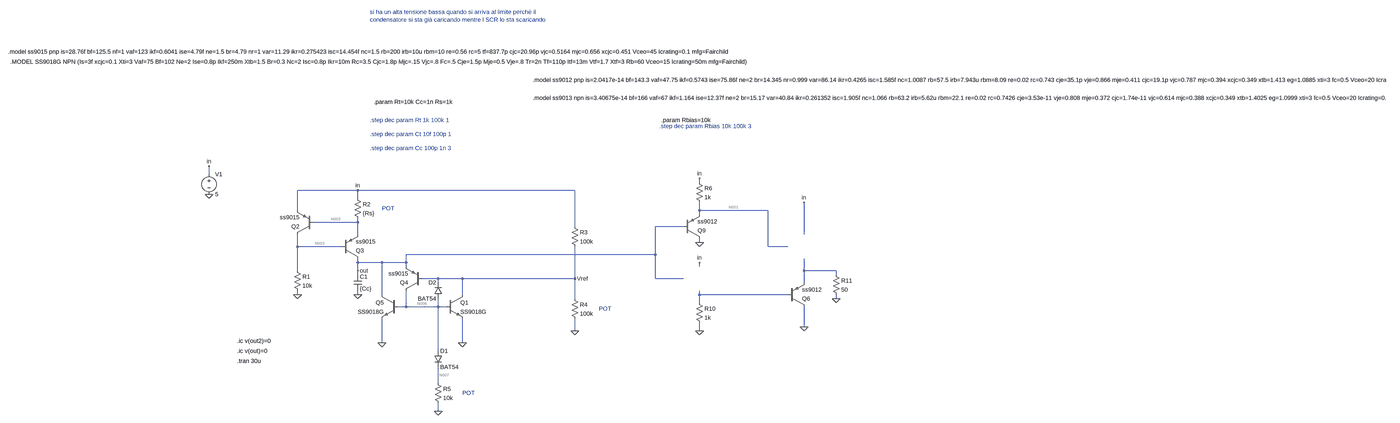
[diagram p0: schematic Sawtooth pier_2.asc, whole sheet]
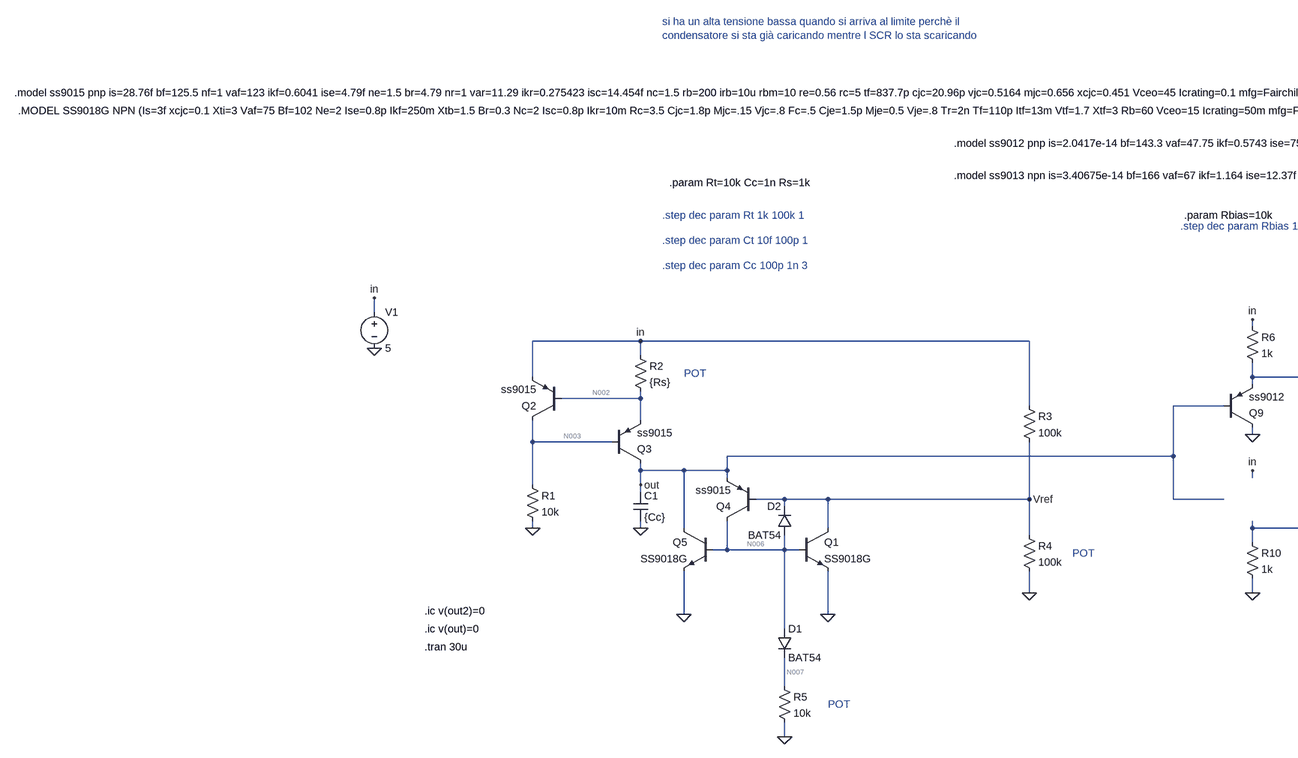
[diagram p1: schematic Sawtooth pier_2.asc, part, row 1 of 1, column 1 of 2]
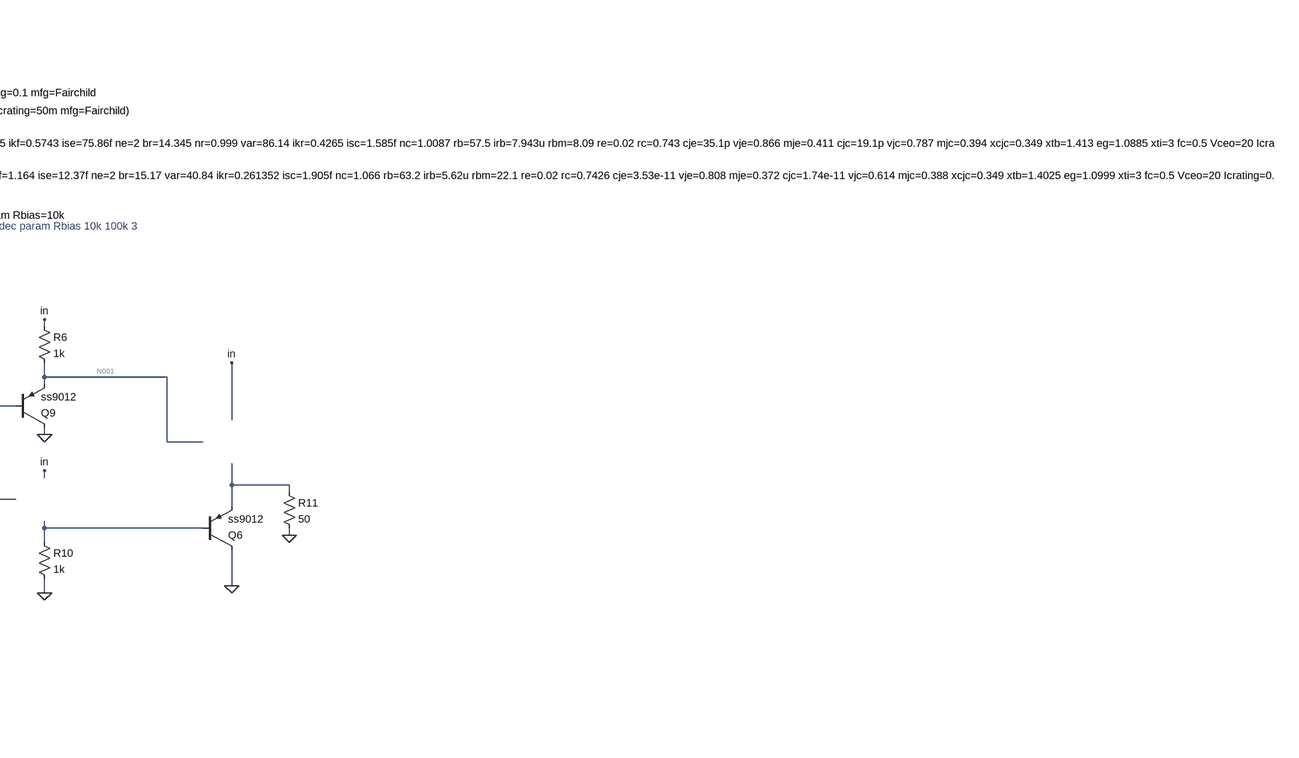
[diagram p2: schematic Sawtooth pier_2.asc, part, row 1 of 1, column 2 of 2]
Sawtooth pier_2.asc, the LTspice schematic file:
Version 4.1
SHEET 1 5468 1760
WIRE -320 -64 -320 -96
WIRE 1632 -32 1632 -48
WIRE 272 0 32 0
WIRE 1136 0 272 0
WIRE 272 32 272 0
WIRE 32 80 32 0
WIRE 1632 80 1632 48
WIRE 1904 80 1632 80
WIRE 1632 96 1632 80
WIRE 272 128 272 112
WIRE 272 128 96 128
WIRE 1136 144 1136 0
WIRE 1568 144 1456 144
WIRE 272 176 272 128
WIRE 2048 176 2048 48
WIRE 1632 208 1632 192
WIRE 32 224 32 176
WIRE 208 224 32 224
WIRE 1904 224 1904 80
WIRE 1984 224 1904 224
WIRE 1456 256 1456 144
WIRE 1456 256 464 256
WIRE 272 288 272 272
WIRE 368 288 272 288
WIRE 464 288 464 256
WIRE 464 288 368 288
WIRE 464 304 464 288
WIRE 1632 304 1632 288
WIRE 32 320 32 224
WIRE 272 320 272 288
WIRE 2048 320 2048 272
WIRE 2176 320 2048 320
WIRE 272 336 272 320
WIRE 2176 336 2176 320
WIRE 592 352 528 352
WIRE 688 352 592 352
WIRE 1136 352 1136 224
WIRE 1136 352 688 352
WIRE 1456 352 1456 256
WIRE 1568 352 1456 352
WIRE 592 368 592 352
WIRE 2048 368 2048 320
WIRE 32 416 32 400
WIRE 272 416 272 400
WIRE 368 416 368 288
WIRE 688 416 688 352
WIRE 1632 416 1632 400
WIRE 1984 416 1632 416
WIRE 1136 432 1136 352
WIRE 2176 432 2176 416
WIRE 1632 448 1632 416
WIRE 464 464 464 400
WIRE 464 464 432 464
WIRE 592 464 592 432
WIRE 592 464 464 464
WIRE 624 464 592 464
WIRE 2048 544 2048 464
WIRE 1136 560 1136 512
WIRE 1632 560 1632 528
WIRE 368 608 368 512
WIRE 688 608 688 512
WIRE 592 640 592 464
WIRE 592 768 592 704
WIRE 592 880 592 848
FLAG -320 16 0
FLAG -320 -96 in
FLAG 32 416 0
FLAG 272 416 0
FLAG 1136 560 0
FLAG 688 608 0
FLAG 272 320 out
FLAG 368 608 0
FLAG 272 0 in
FLAG 592 880 0
FLAG 1136 352 Vref
FLAG 2048 48 in
FLAG 2048 544 0
FLAG 1632 560 0
FLAG 1632 208 0
FLAG 1632 288 in
FLAG 1632 -48 in
FLAG 2176 432 0
SYMBOL voltage -320 -80 R0
WINDOW 123 0 0 Left 0
WINDOW 39 0 0 Left 0
SYMATTR InstName V1
SYMATTR Value 5
SYMBOL res 16 304 R0
SYMATTR InstName R1
SYMATTR Value 10k
SYMBOL res 256 16 R0
SYMATTR InstName R2
SYMATTR Value {Rs}
SYMBOL cap 256 336 R0
SYMATTR InstName C1
SYMATTR Value {Cc}
SYMBOL res 1120 128 R0
SYMATTR InstName R3
SYMATTR Value 100k
SYMBOL res 1120 416 R0
SYMATTR InstName R4
SYMATTR Value 100k
SYMBOL npn 624 416 R0
SYMATTR InstName Q1
SYMATTR Value SS9018G
SYMBOL pnp 96 176 R180
SYMATTR InstName Q2
SYMATTR Value ss9015
SYMBOL res 576 752 R0
SYMATTR InstName R5
SYMATTR Value 10k
SYMBOL diode 576 640 R0
SYMATTR InstName D1
SYMATTR Value BAT54
SYMBOL diode 608 432 R180
WINDOW 0 24 64 Left 2
WINDOW 3 24 0 Left 2
SYMATTR InstName D2
SYMATTR Value BAT54
SYMBOL pnp 208 272 M180
SYMATTR InstName Q3
SYMATTR Value ss9015
SYMBOL pnp 528 400 R180
SYMATTR InstName Q4
SYMATTR Value ss9015
SYMBOL npn 432 416 M0
SYMATTR InstName Q5
SYMATTR Value SS9018G
SYMBOL res 1616 432 R0
SYMATTR InstName R10
SYMATTR Value 1k
SYMBOL pnp 1568 192 M180
SYMATTR InstName Q9
SYMATTR Value ss9012
SYMBOL res 1616 -48 R0
SYMATTR InstName R6
SYMATTR Value 1k
SYMBOL res 2160 320 R0
SYMATTR InstName R11
SYMATTR Value 50
SYMBOL pnp 1984 464 M180
SYMATTR InstName Q6
SYMATTR Value ss9012
TEXT 320 -280 Left 2 ;.step dec param Rt 1k 100k 1
TEXT 336 -352 Left 2 !.param Rt=10k Cc=1n Rs=1k
TEXT 320 -224 Left 2 ;.step dec param Ct 10f 100p 1
TEXT -1120 -552 Left 2 !.model ss9015 pnp is=28.76f bf=125.5 nf=1 vaf=123 ikf=0.6041 ise=4.79f ne=1.5 br=4.79 nr=1 var=11.29 ikr=0.275423 isc=14.454f nc=1.5 rb=200 irb=10u rbm=10 re=0.56 rc=5 tf=837.7p cjc=20.96p vjc=0.5164 mjc=0.656 xcjc=0.451 Vceo=45 Icrating=0.1 mfg=Fairchild
TEXT -1112 -512 Left 2 !.MODEL SS9018G NPN (Is=3f xcjc=0.1 Xti=3 Vaf=75 Bf=102 Ne=2 Ise=0.8p Ikf=250m Xtb=1.5 Br=0.3 Nc=2 Isc=0.8p Ikr=10m Rc=3.5 Cjc=1.8p Mjc=.15 Vjc=.8 Fc=.5 Cje=1.5p Mje=0.5 Vje=.8 Tr=2n Tf=110p Itf=13m Vtf=1.7 Xtf=3 Rb=60 Vceo=15 Icrating=50m mfg=Fairchild)
TEXT 320 -776 Left 2 ;si ha un alta tensione bassa quando si arriva al limite perchè il\ncondensatore si sta già caricando mentre l SCR lo sta scaricando
TEXT 320 -168 Left 2 ;.step dec param Cc 100p 1n 3
TEXT -208 600 Left 2 !.ic v(out2)=0
TEXT 368 72 Left 2 ;POT
TEXT 688 808 Left 2 ;POT
TEXT -208 680 Left 2 !.tran 30u
TEXT -208 640 Left 2 !.ic v(out)=0
TEXT 1232 472 Left 2 ;POT
TEXT 1480 -280 Left 2 !.param Rbias=10k
TEXT 1472 -256 Left 2 ;.step dec param Rbias 10k 100k 3
TEXT 968 -440 Left 2 !.model ss9012 pnp is=2.0417e-14 bf=143.3 vaf=47.75 ikf=0.5743 ise=75.86f ne=2 br=14.345 nr=0.999 var=86.14 ikr=0.4265 isc=1.585f nc=1.0087 rb=57.5 irb=7.943u rbm=8.09 re=0.02 rc=0.743 cje=35.1p vje=0.866 mje=0.411 cjc=19.1p vjc=0.787 mjc=0.394 xcjc=0.349 xtb=1.413 eg=1.0885 xti=3 fc=0.5 Vceo=20 Icrating=0.5 mfg=Fairchild
TEXT 968 -368 Left 2 !.model ss9013 npn is=3.40675e-14 bf=166 vaf=67 ikf=1.164 ise=12.37f ne=2 br=15.17 var=40.84 ikr=0.261352 isc=1.905f nc=1.066 rb=63.2 irb=5.62u rbm=22.1 re=0.02 rc=0.7426 cje=3.53e-11 vje=0.808 mje=0.372 cjc=1.74e-11 vjc=0.614 mjc=0.388 xcjc=0.349 xtb=1.4025 eg=1.0999 xti=3 fc=0.5 Vceo=20 Icrating=0.5 mfg=Fairchild

The netlist it stands for:
* Sawtooth pier_2.asc
V1 in 0 5
R1 N003 0 10k
R2 in N002 {Rs}
C1 out 0 {Cc}
R3 in Vref 100k
R4 Vref 0 100k
Q1 Vref N006 0 0 SS9018G
Q2 N003 N002 in 0 ss9015
R5 N007 0 10k
D1 N006 N007 BAT54
D2 N006 Vref BAT54
Q3 out N003 N002 0 ss9015
Q4 N006 Vref out 0 ss9015
Q5 out N006 0 0 SS9018G
R10 N005 0 1k
Q9 0 out N001 0 ss9012
R6 in N001 1k
R11 N004 0 50
Q6 0 N005 N004 0 ss9012
.model D D
.lib standard.dio
.model NPN NPN
.model PNP PNP
.lib standard.bjt
* .step dec param Rt 1k 100k 1
.param Rt=10k Cc=1n Rs=1k
* .step dec param Ct 10f 100p 1
.model ss9015 pnp is=28.76f bf=125.5 nf=1 vaf=123 ikf=0.6041 ise=4.79f ne=1.5 br=4.79 nr=1 var=11.29 ikr=0.275423 isc=14.454f nc=1.5 rb=200 irb=10u rbm=10 re=0.56 rc=5 tf=837.7p cjc=20.96p vjc=0.5164 mjc=0.656 xcjc=0.451 Vceo=45 Icrating=0.1 mfg=Fairchild
.MODEL SS9018G NPN (Is=3f xcjc=0.1 Xti=3 Vaf=75 Bf=102 Ne=2 Ise=0.8p Ikf=250m Xtb=1.5 Br=0.3 Nc=2 Isc=0.8p Ikr=10m Rc=3.5 Cjc=1.8p Mjc=.15 Vjc=.8 Fc=.5 Cje=1.5p Mje=0.5 Vje=.8 Tr=2n Tf=110p Itf=13m Vtf=1.7 Xtf=3 Rb=60 Vceo=15 Icrating=50m mfg=Fairchild)
* si ha un alta tensione bassa quando si arriva al limite perchè il
* condensatore si sta già caricando mentre l SCR lo sta scaricando
* .step dec param Cc 100p 1n 3
.ic v(out2)=0
* POT
* POT
.tran 30u
.ic v(out)=0
* POT
.param Rbias=10k
* .step dec param Rbias 10k 100k 3
.model ss9012 pnp is=2.0417e-14 bf=143.3 vaf=47.75 ikf=0.5743 ise=75.86f ne=2 br=14.345 nr=0.999 var=86.14 ikr=0.4265 isc=1.585f nc=1.0087 rb=57.5 irb=7.943u rbm=8.09 re=0.02 rc=0.743 cje=35.1p vje=0.866 mje=0.411 cjc=19.1p vjc=0.787 mjc=0.394 xcjc=0.349 xtb=1.413 eg=1.0885 xti=3 fc=0.5 Vceo=20 Icrating=0.5 mfg=Fairchild
.model ss9013 npn is=3.40675e-14 bf=166 vaf=67 ikf=1.164 ise=12.37f ne=2 br=15.17 var=40.84 ikr=0.261352 isc=1.905f nc=1.066 rb=63.2 irb=5.62u rbm=22.1 re=0.02 rc=0.7426 cje=3.53e-11 vje=0.808 mje=0.372 cjc=1.74e-11 vjc=0.614 mjc=0.388 xcjc=0.349 xtb=1.4025 eg=1.0999 xti=3 fc=0.5 Vceo=20 Icrating=0.5 mfg=Fairchild
.backanno
.end

* Results of the author's LTspice run, read from the files saved beside the schematic
* Operating Point, zero values left out:
*   V(in) = 5 V
*   V(n001) = 675.6 mV
*   V(n002) = 4.396 V
*   V(n003) = 3.779 V
*   V(n006) = 18.93 mV
*   V(n007) = 1 mV
*   V(vref) = 2.495 V
*   I(D1) = 100 nA
*   I(D2) = -100 nA
*   I(R1) = 377.9 µA
*   I(R2) = 604.2 µA
*   I(R3) = 25.05 µA
*   I(R4) = 24.95 µA
*   I(R5) = 100 nA
*   I(R6) = 4.324 mA
*   I(V1) = -5.33 mA
*   Ib(Q1) = -2.914 pA
*   Ib(Q2) = -3.153 µA
*   Ib(Q3) = -4.959 µA
*   Ib(Q4) = 4.997 pA
*   Ib(Q9) = -30.47 µA
*   Ic(Q1) = 3.293 pA
*   Ic(Q2) = -373 µA
*   Ic(Q3) = -602.4 µA
*   Ic(Q4) = -2.497 pA
*   Ic(Q9) = -4.294 mA
*   Ie(Q2) = 376.1 µA
*   Ie(Q3) = 607.4 µA
*   Ie(Q4) = -2.5 pA
*   Ie(Q9) = 4.324 mA
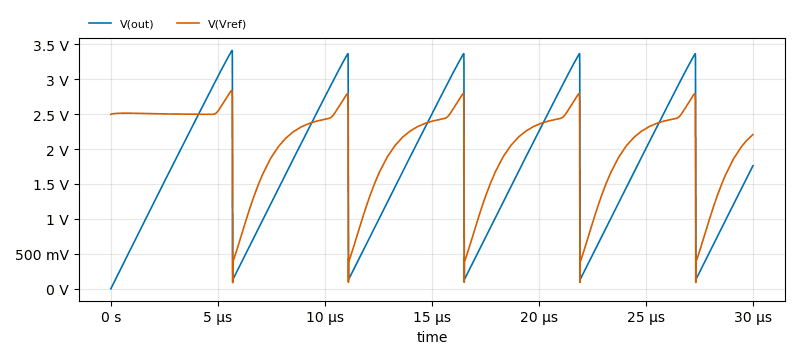
[diagram p3: Transient Analysis of Sawtooth pier_2.asc, plotted from the saved traces]
* Transient Analysis, 1 run:
*   V(out): min 0 V, max 3.412 V, average 1.689 V, rms 1.939 V, last 1.759 V
*   V(Vref): min 88.19 mV, max 2.838 V, average 2.022 V, rms 2.116 V, last 2.207 V